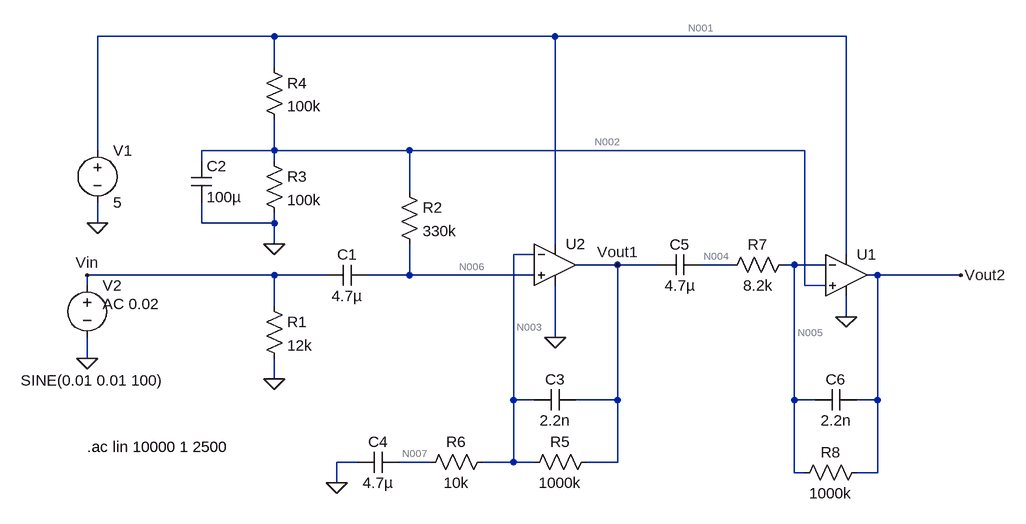
[diagram p0: schematic Amp simulation.asc]
Amp simulation.asc, the LTspice schematic file:
Version 4
SHEET 1 1204 680
WIRE 64 -272 -208 -272
WIRE 496 -272 64 -272
WIRE 944 -272 496 -272
WIRE 64 -224 64 -272
WIRE -208 -96 -208 -272
WIRE 64 -96 64 -144
WIRE 64 -96 -48 -96
WIRE 272 -96 64 -96
WIRE 880 -96 272 -96
WIRE -48 -80 -48 -96
WIRE 64 -80 64 -96
WIRE 272 -32 272 -96
WIRE -208 16 -208 -16
WIRE -48 16 -48 -16
WIRE 64 16 64 0
WIRE 64 16 -48 16
WIRE 64 48 64 16
WIRE 496 48 496 -272
WIRE 464 64 432 64
WIRE 944 64 944 -272
WIRE 592 80 528 80
WIRE 656 80 592 80
WIRE 768 80 720 80
WIRE 864 80 848 80
WIRE 912 80 864 80
WIRE 64 96 -224 96
WIRE 144 96 64 96
WIRE 272 96 272 48
WIRE 272 96 208 96
WIRE 464 96 272 96
WIRE 992 96 976 96
WIRE 1120 96 992 96
WIRE -224 112 -224 96
WIRE 880 112 880 -96
WIRE 912 112 880 112
WIRE 64 144 64 96
WIRE 944 160 944 128
WIRE 496 192 496 112
WIRE -224 224 -224 192
WIRE 64 256 64 224
WIRE 432 288 432 64
WIRE 464 288 432 288
WIRE 592 288 592 80
WIRE 592 288 528 288
WIRE 864 288 864 80
WIRE 896 288 864 288
WIRE 992 288 992 96
WIRE 992 288 960 288
WIRE 192 384 160 384
WIRE 304 384 256 384
WIRE 432 384 432 288
WIRE 432 384 384 384
WIRE 464 384 432 384
WIRE 592 384 592 288
WIRE 592 384 544 384
WIRE 864 400 864 288
WIRE 880 400 864 400
WIRE 992 400 992 288
WIRE 992 400 960 400
WIRE 160 416 160 384
FLAG 64 256 0
FLAG -208 16 0
FLAG 496 192 0
FLAG 160 416 0
FLAG -224 224 0
FLAG -224 96 Vin
FLAG 944 160 0
FLAG 592 80 Vout1
FLAG 1120 96 Vout2
FLAG 64 48 0
SYMBOL res 48 128 R0
SYMATTR InstName R1
SYMATTR Value 12k
SYMBOL cap 208 80 R90
WINDOW 0 0 32 VBottom 2
WINDOW 3 32 32 VTop 2
SYMATTR InstName C1
SYMATTR Value 4.7µ
SYMBOL res 256 -48 R0
SYMATTR InstName R2
SYMATTR Value 330k
SYMBOL cap -64 -80 R0
SYMATTR InstName C2
SYMATTR Value 100µ
SYMBOL voltage -208 -112 R0
WINDOW 123 0 0 Left 0
WINDOW 39 0 0 Left 0
SYMATTR InstName V1
SYMATTR Value 5
SYMBOL cap 528 272 R90
WINDOW 0 0 32 VBottom 2
WINDOW 3 32 32 VTop 2
SYMATTR InstName C3
SYMATTR Value 2.2n
SYMBOL res 400 368 R90
WINDOW 0 0 56 VBottom 2
WINDOW 3 32 56 VTop 2
SYMATTR InstName R6
SYMATTR Value 10k
SYMBOL cap 256 368 R90
WINDOW 0 0 32 VBottom 2
WINDOW 3 32 32 VTop 2
SYMATTR InstName C4
SYMATTR Value 4.7µ
SYMBOL voltage -224 96 R0
WINDOW 3 -102 162 Left 2
WINDOW 123 24 44 Left 2
WINDOW 39 0 0 Left 0
SYMATTR InstName V2
SYMATTR Value SINE(0.01 0.01 100)
SYMATTR Value2 AC 0.02
SYMBOL OpAmps\\UniversalOpamp2 496 80 R0
SYMATTR InstName U2
SYMBOL OpAmps\\UniversalOpamp2 944 96 R0
SYMATTR InstName U1
SYMBOL cap 720 64 R90
WINDOW 0 0 32 VBottom 2
WINDOW 3 32 32 VTop 2
SYMATTR InstName C5
SYMATTR Value 4.7µ
SYMBOL res 864 64 R90
WINDOW 0 0 56 VBottom 2
WINDOW 3 32 56 VTop 2
SYMATTR InstName R7
SYMATTR Value 8.2k
SYMBOL cap 960 272 R90
WINDOW 0 0 32 VBottom 2
WINDOW 3 32 32 VTop 2
SYMATTR InstName C6
SYMATTR Value 2.2n
SYMBOL res 48 -96 R0
SYMATTR InstName R3
SYMATTR Value 100k
SYMBOL res 48 -240 R0
SYMATTR InstName R4
SYMATTR Value 100k
SYMBOL res 560 368 R90
WINDOW 0 0 56 VBottom 2
WINDOW 3 32 56 VTop 2
SYMATTR InstName R5
SYMATTR Value 1000k
SYMBOL res 976 384 R90
WINDOW 0 0 56 VBottom 2
WINDOW 3 32 56 VTop 2
SYMATTR InstName R8
SYMATTR Value 1000k
TEXT -224 360 Left 2 !.ac lin 10000 1 2500

The netlist it stands for:
* Amp simulation.asc
R1 Vin 0 12k
C1 N006 Vin 4.7µ
R2 N002 N006 330k
C2 N002 0 100µ
V1 N001 0 5
C3 Vout1 N003 2.2n
R6 N003 N007 10k
C4 N007 0 4.7µ
V2 Vin 0 SINE(0.01 0.01 100) AC 0.02
XU2 N006 N003 N001 0 Vout1 level.2 Avol=1Meg GBW=10Meg Slew=10Meg ilimit=25m rail=0 Vos=0 phimargin=45 en=0 enk=0 in=0 ink=0 Rin=500Meg  ; pins IN+ IN- V+ V- OUT
XU1 N002 N005 N001 0 Vout2 level.2 Avol=1Meg GBW=10Meg Slew=10Meg ilimit=25m rail=0 Vos=0 phimargin=45 en=0 enk=0 in=0 ink=0 Rin=500Meg  ; pins IN+ IN- V+ V- OUT
C5 N004 Vout1 4.7µ
R7 N005 N004 8.2k
C6 Vout2 N005 2.2n
R3 N002 0 100k
R4 N001 N002 100k
R5 Vout1 N003 1000k
R8 Vout2 N005 1000k
.ac lin 10000 1 2500
.lib UniversalOpamps2.sub
.backanno
.end

* Results of the author's LTspice run, read from the files saved beside the schematic
* Operating Point, zero values left out:
*   V(vin) = 10 mV
*   V(n006) = 2.5 V
*   V(n002) = 2.5 V
*   V(n001) = 5 V
*   V(vout1) = 2.5 V
*   V(n003) = 2.5 V
*   V(n007) = 2.5 V
*   V(vout2) = 2.5 V
*   V(n005) = 2.5 V
*   V(n004) = 2.5 V
*   I(R4) = 25 µA
*   I(R3) = 25 µA
*   I(R1) = 833.3 nA
*   I(V2) = -833.3 nA
*   I(V1) = -525 µA
*   Ix(u2:3) = 250 µA
*   Ix(u2:4) = -250 µA
*   Ix(u2:5) = 210.8 pA
*   Ix(u1:3) = 250 µA
*   Ix(u1:4) = -250 µA
*   Ix(u1:5) = 231.2 pA